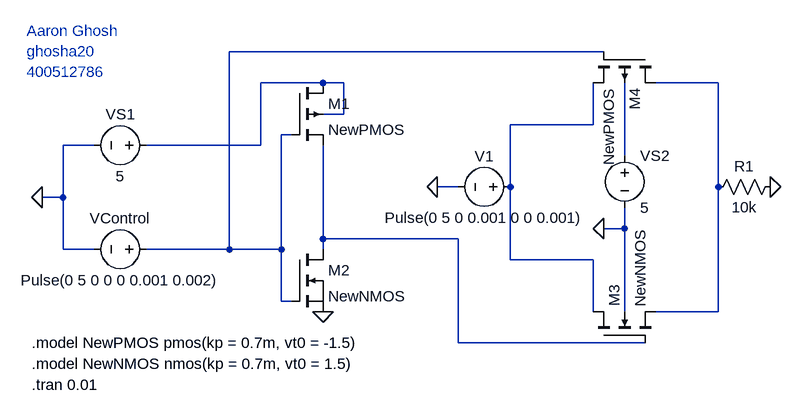
[diagram p0: schematic Project 2 Switch 1.asc]
Project 2 Switch 1.asc, the LTspice schematic file:
Version 4.1
SHEET 1 1108 680
WIRE 736 -48 160 -48
WIRE 304 0 208 0
WIRE 336 0 304 0
WIRE 912 0 816 0
WIRE 336 48 336 0
WIRE 336 48 304 48
WIRE 720 64 720 0
WIRE 720 64 592 64
WIRE 256 80 240 80
WIRE -48 96 -96 96
WIRE 208 96 208 0
WIRE 208 96 32 96
WIRE 768 112 768 0
WIRE 512 160 480 160
WIRE 592 160 592 64
WIRE 912 160 912 0
WIRE -96 176 -96 96
WIRE -96 176 -128 176
WIRE 768 224 768 192
WIRE 768 224 736 224
WIRE 304 240 304 96
WIRE 512 240 304 240
WIRE -96 256 -96 176
WIRE -48 256 -96 256
WIRE 160 256 160 -48
WIRE 160 256 32 256
WIRE 240 256 240 80
WIRE 240 256 160 256
WIRE 304 256 304 240
WIRE 592 272 592 160
WIRE 720 272 592 272
WIRE 240 336 240 256
WIRE 256 336 240 336
WIRE 720 352 720 272
WIRE 768 352 768 224
WIRE 912 352 912 160
WIRE 912 352 816 352
WIRE 512 400 512 240
WIRE 800 400 512 400
FLAG -128 176 0
FLAG 480 160 0
FLAG 992 160 0
FLAG 736 224 0
FLAG 304 352 0
SYMBOL voltage 48 96 R90
WINDOW 0 -32 56 VBottom 2
WINDOW 3 32 56 VTop 2
SYMATTR InstName VS1
SYMATTR Value 5
SYMBOL voltage 48 256 R90
WINDOW 0 -32 56 VBottom 2
WINDOW 3 32 56 VTop 2
SYMATTR InstName VControl
SYMATTR Value Pulse(0 5 0 0 0 0.001 0.002)
SYMBOL voltage 608 160 R90
WINDOW 0 -32 56 VBottom 2
WINDOW 3 32 56 VTop 2
SYMATTR InstName V1
SYMATTR Value Pulse(0 5 0 0.001 0 0 0.001)
SYMBOL voltage 768 96 R0
SYMATTR InstName VS2
SYMATTR Value 5
SYMBOL pmos4 256 0 R0
SYMATTR InstName M1
SYMATTR Value NewPMOS
SYMBOL nmos 256 256 R0
SYMATTR InstName M2
SYMATTR Value NewNMOS
SYMBOL nmos4 720 400 R270
SYMATTR InstName M3
SYMATTR Value NewNMOS
SYMBOL pmos4 816 -48 R90
SYMATTR InstName M4
SYMATTR Value NewPMOS
SYMBOL res 1008 144 R90
WINDOW 0 0 56 VBottom 2
WINDOW 3 32 56 VTop 2
SYMATTR InstName R1
SYMATTR Value 10k
TEXT -144 400 Left 2 !.model NewPMOS pmos(kp = 0.7m, vt0 = -1.5)
TEXT -144 432 Left 2 !.model NewNMOS nmos(kp = 0.7m, vt0 = 1.5)
TEXT -144 464 Left 2 !.tran 0.01
TEXT -152 -80 Left 2 ;Aaron Ghosh\nghosha20\n400512786

The netlist it stands for:
* Project 2 Switch 1.asc
VS1 N002 0 5
VControl N001 0 Pulse(0 5 0 0 0 0.001 0.002)
V1 N004 0 Pulse(0 5 0 0.001 0 0 0.001)
VS2 N005 0 5
M1 N002 N001 N006 N002 NewPMOS
M2 N006 N001 0 0 NewNMOS
M3 N004 N006 N003 0 NewNMOS
M4 N003 N001 N004 N005 NewPMOS
R1 0 N003 10k
.model NMOS NMOS
.model PMOS PMOS
.lib standard.mos
.model NewPMOS pmos(kp = 0.7m, vt0 = -1.5)
.model NewNMOS nmos(kp = 0.7m, vt0 = 1.5)
.tran 0.01
* Aaron Ghosh
* ghosha20
* 400512786
.backanno
.end